# Altium schematic sheet Connectivity.SchDoc
size A4; SheetNumber: 3; SheetTotal: 3
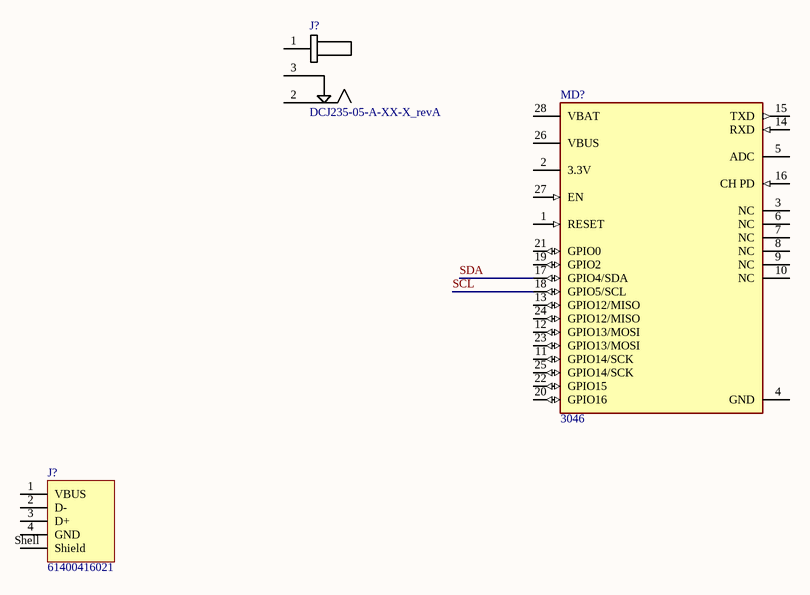
[diagram p0: Connectivity.SchDoc]

## Parts
(Parts that share a designator on the sheet are numbered #1, #2 ... from top to bottom, then left to right.)
J?#1  DCJ235-05-A-XX-X_revA  [DCJ235-05-A-XX-X_revA]
J?#2  61400416021  [61400416021]
MD?  3046  [FP-3046-MFG]

## Nets
SCL: MD?.18(GPIO5/SCL)
SDA: MD?.17(GPIO4/SDA)

Not connected (* = marked no-connect by the designer): J?#1 1 2 3; J?#2 1(VBUS) 2(D-) 3(D+) 4(GND) Shell(Shield); MD? 1(RESET) 2(3.3V) 3(NC) 4(GND) 5(ADC) 6(NC) 7(NC) 8(NC) 9(NC) 10(NC) 11(GPIO14/SCK) 12(GPIO13/MOSI) 13(GPIO12/MISO) 14(RXD) 15(TXD) 16(CH_PD) 19(GPIO2) 20(GPIO16) 21(GPIO0) 22(GPIO15) 23(GPIO13/MOSI) 24(GPIO12/MISO) 25(GPIO14/SCK) 26(VBUS) 27(EN) 28(VBAT)

## Library data of the parts
J?#1 = CMP-003-000000-1: DC Power Jack, Thru-Hole, Horizontal, with Locating Pegs, D2.35mm; Source: DCJ235-05-A-XX-X_revA.SchLib; Design Item ID: DCJ235-05-A-XX-X_revA; Pin Count: 3; Component Type: Standard
J?#2 = CMP-002-00072-1: USB Connector, 4 Contact(s), Female, Right Angle, Solder Terminal, Locking, Receptacle
MD? = CMP-144213-000001-1: ESP8266 FEATHER HUZZAH FIXED HDR; Frequency: 2.4GHz